# Altium schematic sheet Papilio_DUO_1.SchDoc: Papilio_DUO
size 270 x 207 mm; Date: 05/10/2018 09:53:54 p.m.; Organization: INVAP S.E.; Address1: Argentina; Address2: Rio Negro; Address3: Bariloche; Address4: Cte. Luis Piedra Buena 4950; SheetNumber: 2; DATABASE: C:/Dropbox/GadgetFactory/GadgetFactory_Engineering/Libraries/GadgetFactory-PARTSDB.txt; Rule: PcbType=ProtelPcb
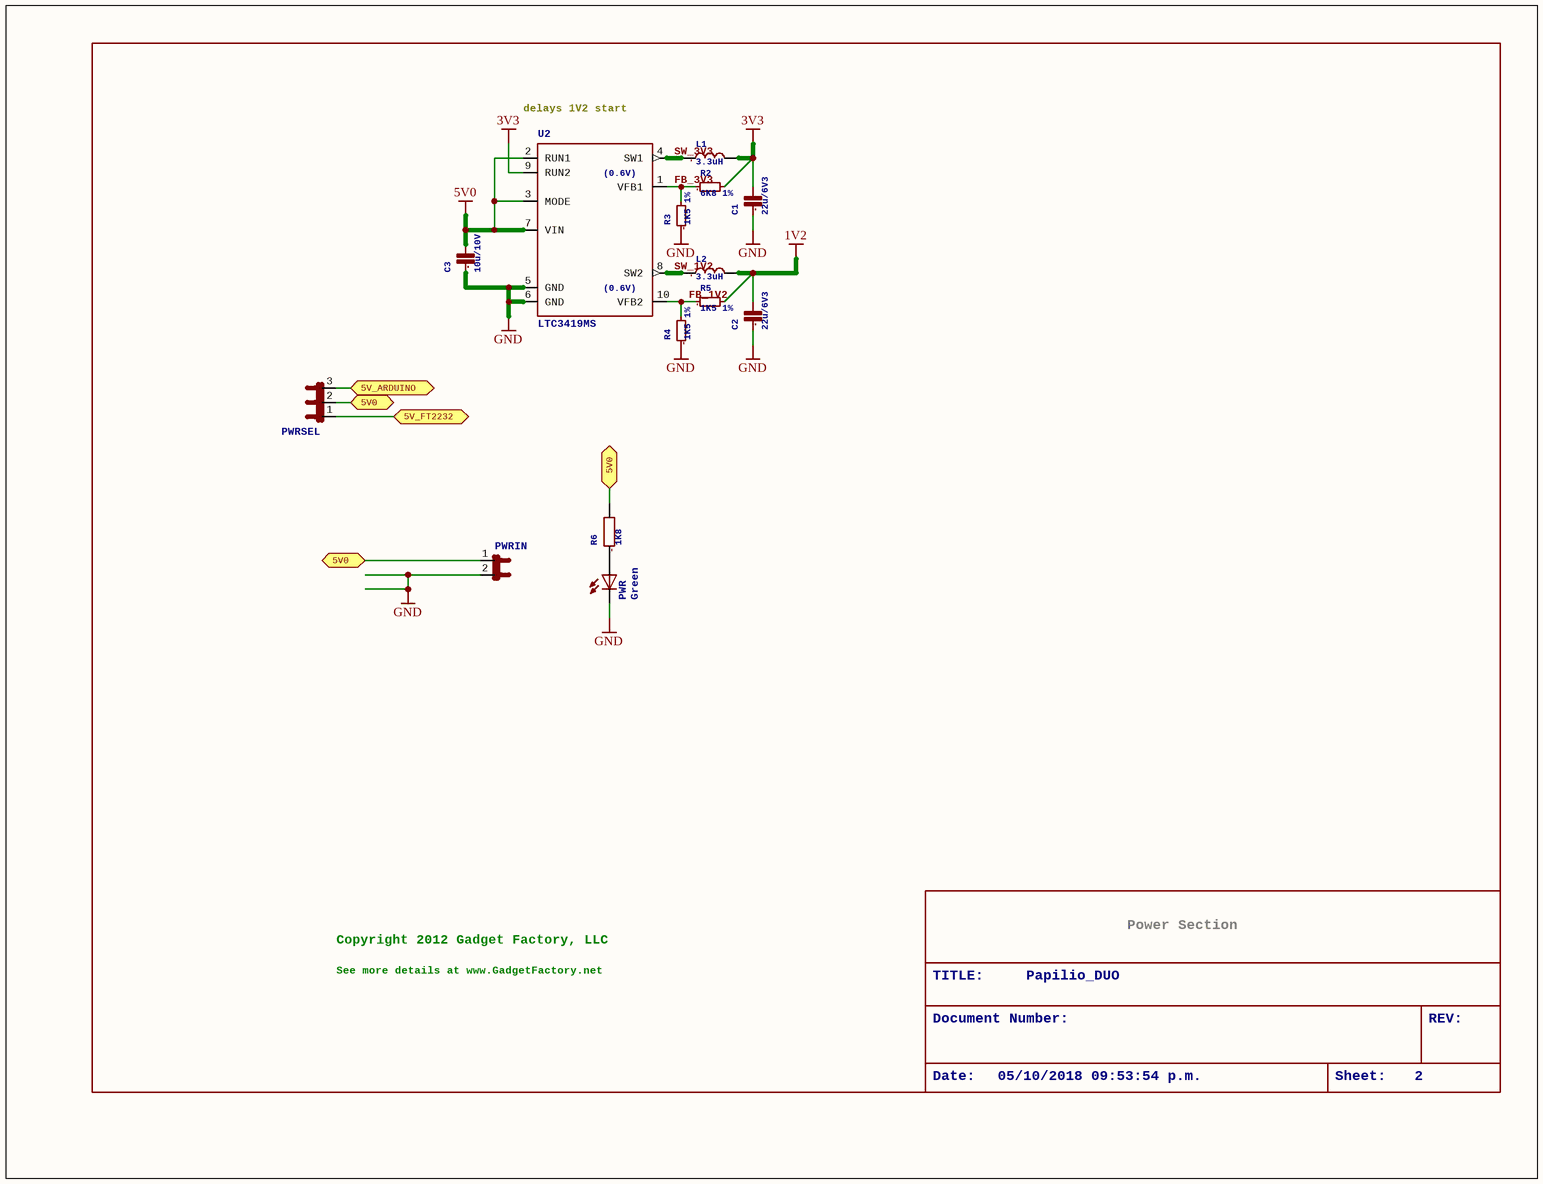
[diagram p0: Papilio_DUO_1.SchDoc]

## Parts
C1  22u/6V3  [0805]
C2  22u/6V3  [0805]
C3  10u/10V  [0805]
L1  3.3uH  [VLS3015]
L2  3.3uH  [VLS3015]
PWR  Green  [CHIP-LED0805]
PWRIN  JP1E  [JP1]  (value not drawn)
PWRSEL  JP2E  [JP2]  (value not drawn)
R2  6K8 1%  [0603]
R3  1K5 1%  [0603]
R4  1K5 1%  [0603]
R5  1K5 1%  [0603]
R6  1K8  [0603]
U2  LTC3419MS  [MSOP10]

## Ports
5V0, 5V_ARDUINO, 5V_FT2232

## Nets
1V2: C2.2 L2.2 R5.2
3V3: C1.2 L1.2 R2.2 U2.9(RUN2)
5V0: C3.2 U2.2(RUN1) U2.3(MODE) U2.7(VIN)
GND: C1.1 C2.1 C3.1 PWR.C PWRIN.2 R3.1 R4.1 U2.5(GND) U2.6(GND)
5V0: PWRIN.1 PWRSEL.2 R6.2 ; port 5V0  [a separate net that carries the same name]
5V_ARDUINO: PWRSEL.3 ; port 5V_ARDUINO
5V_FT2232: PWRSEL.1 ; port 5V_FT2232
FB_1V2: R4.2 R5.1 U2.10(VFB2)
FB_3V3: R2.1 R3.2 U2.1(VFB1)
SW_1V2: L2.1 U2.8(SW2)
SW_3V3: L1.1 U2.4(SW1)
NetPWR_A: PWR.A R6.1

## Notes on the sheet
- (near U2) delays 1V2 start
- Copyright 2012 Gadget Factory, LLC
- See more details at www.GadgetFactory.net
- TITLE:
- Papilio_DUO
- Power Section
- Document Number:
- REV:
- Date:
- 05/10/2018 09:53:54 p.m.
- Sheet:
- 2
- Título:
- Nº
- Hoja:
- de:
- Escala:
- *

## Library data of the parts
C1-C3 = C0805: CAPACITOR, European symbol; PARTNO: *
L1 L2 = L_VLS3015: INDUCTOR, European symbol; PARTNO: *
PWR = LEDCHIP-LED0805: LED   OSRAM: - CHIPLED LG R971, LG N971, LY N971, LG Q971, LY Q971, LO R971, LY R971 LH N974, LH R974 LS Q976, LO Q976, LY Q976 LO Q996 - Hyper CHIPLED LW Q18S LB Q993, LB Q99A, LB R99A - SideLED LS A670, LO A670, LY A670, LG A670, LP A670 LB A673, LV A673, LT A673, LW A673 LH A674 LY A675 LS A676, LA A676, LO A676, LY A676, LW A676 LS A679, LY A679, LG A679 -  Hyper Micro SIDELEDï¿½ LS Y876, LA Y876, LO Y876, LY Y876 LT Y87S - SmartLED LW L88C, LW L88S LB L89C, LB L89S, LG L890 LS L89K, LO L89K, LY L89K LS L896, LA L896, LO L896, LY L896 - TOPLED LS T670, LO T670, LY T670, LG T670, LP T670 LSG T670, LSP T670, LSY T670, LOP T670, LYG T670 LG T671, LOG T671, LSG T671 LB T673, LV T673, LT T673, LW T673 LH T674 LS T676, LA T676, LO T676, LY T676, LB T676, LH T676, LSB T676, LW T676 LB T67C, LV T67C, LT T67C, LS T67K, LO T67K, LY T67K, LW E67C LS E67B, LA E67B, LO E67B, LY E67B, LB E67C, LV E67C, LT E67C LW T67C LS T679, LY T679, LG T679 LS T770, LO T770, LY T770, LG T770, LP T770 LB T773, LV T773, LT T773, LW T773 LH T774 LS E675, LA E675, LY E675, LS T675 LS T776, LA T776, LO T776, LY T776, LB T776 LHGB T686 LT T68C, LB T68C - Hyper Mini TOPLEDï¿½ LB M676 - Mini TOPLED Santanaï¿½ LG M470 LS M47K, LO M47K, LY M47K    Source: http://www.osram.convergy.de   LUXEON: - LUMILEDï¿½ LXK2-PW12-R00, LXK2-PW12-S00, LXK2-PW14-U00, LXK2-PW14-V00 LXK2-PM12-R00, LXK2-PM12-S00, LXK2-PM14-U00 LXK2-PE12-Q00, LXK2-PE12-R00, LXK2-PE12-S00, LXK2-PE14-T00, LXK2-PE14-U00 LXK2-PB12-K00, LXK2-PB12-L00, LXK2-PB12-M00, LXK2-PB14-N00, LXK2-PB14-P00, LXK2-PB14-Q00 LXK2-PR12-L00, LXK2-PR12-M00, LXK2-PR14-Q00, LXK2-PR14-R00 LXK2-PD12-Q00, LXK2-PD12-R00, LXK2-PD12-S00 LXK2-PH12-R00, LXK2-PH12-S00 LXK2-PL12-P00, LXK2-PL12-Q00, LXK2-PL12-R00    Source: www.luxeon.com   KINGBRIGHT:   KA-3528ASYC Source: www.kingbright.com; PARTNO: *
PWRIN = JP1E: JUMPER; PARTNO: *
PWRSEL = JP2E: JUMPER; PARTNO: *
R2-R5 = R-SMALL0603: PARTNO: *
R6 = R0603: RESISTOR, European symbol; PARTNO: *
U2 = LTC3419MS: Dual Monolithic 600mA Synchronous Step-Down Regulator; PARTNO: *; (0.6V): (0.6V)